# EAGLE schematic kog (EAGLE 6.5.0)
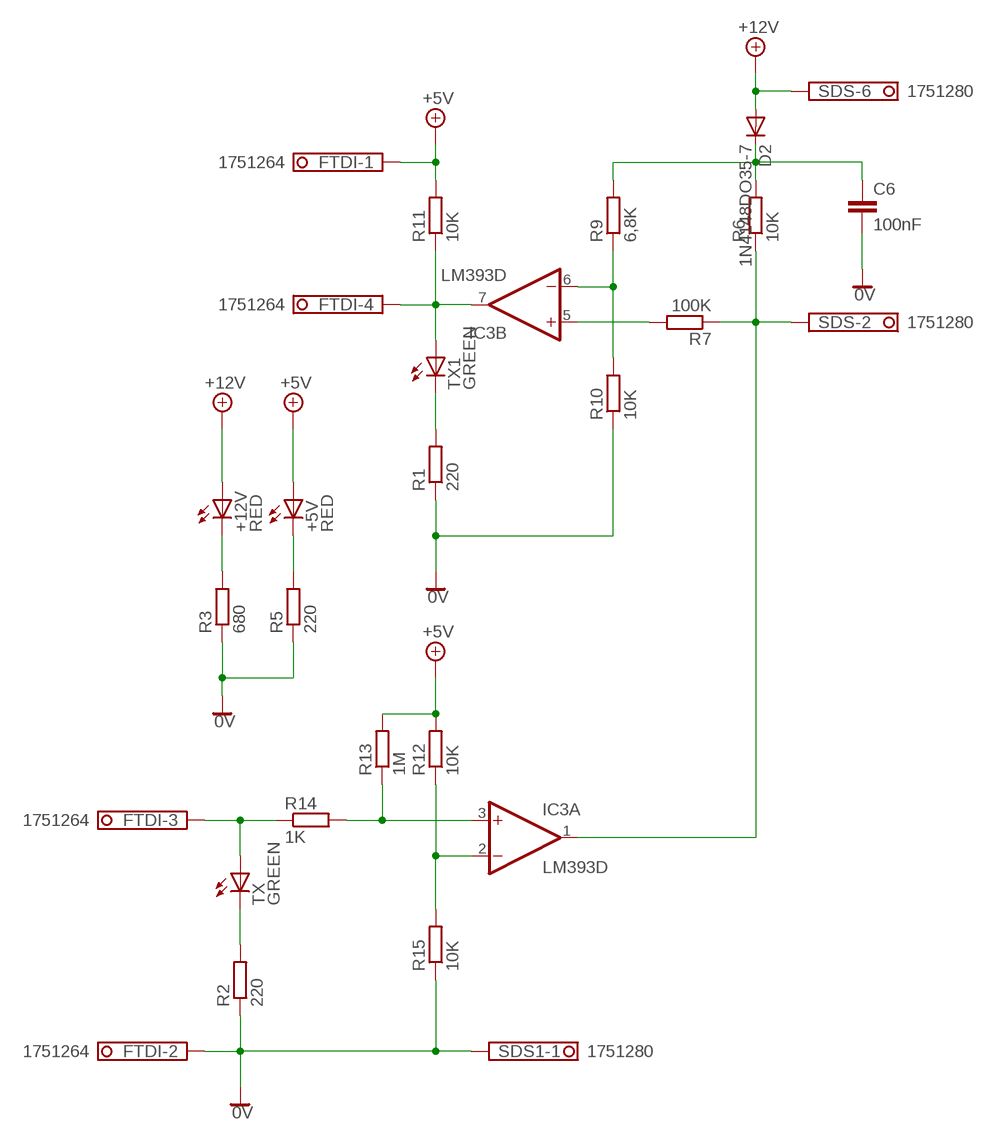
[diagram p0: schematic, sheet 1]

## Parts
+5V  RED  LED5MM  [LED5MM]
+12V  RED  LED5MM  [LED5MM]
C6  100nF  C-EU025-025X050  [C025-025X050]
D2  1N4148DO35-7  [DO35-7]
FTDI  1751264  [1751264]
IC3  LM393D  [SO08]
R1  220  R-EU_0207/10  [0207/10]
R2  220  R-EU_0207/10  [0207/10]
R3  680  R-EU_0207/10  [0207/10]
R5  220  R-EU_0207/10  [0207/10]
R6  10K  R-EU_0207/10  [0207/10]
R7  100K  R-EU_0207/10  [0207/10]
R9  6,8K  R-EU_0207/10  [0207/10]
R10  10K  R-EU_0207/10  [0207/10]
R11  10K  R-EU_0207/10  [0207/10]
R12  10K  R-EU_0207/10  [0207/10]
R13  1M  R-EU_0207/10  [0207/10]
R14  1K  R-EU_0207/10  [0207/10]
R15  10K  R-EU_0207/10  [0207/10]
SDS  1751280  [1751280]
SDS1  1751280  [1751280]
TX  GREEN  LED5MM  [LED5MM]
TX1  GREEN  LED5MM  [LED5MM]

## Nets
0V: C6.2 FTDI.2 R1.1 R2.1 R3.1 R5.1 R10.1 R15.1 SDS1.1
+5V: +5V.A FTDI.1 R11.2 R12.2 R13.2
+12V: +12V.A D2.A SDS.6
N$1: +12V.K(C) R3.2
N$2: C6.1 D2.C R6.2 R9.2
N$3: IC3.1(A:OUT) R6.1 R7.1 SDS.2
N$4: IC3.5(B:+IN) R7.2
N$5: IC3.6(B:-IN) R9.1 R10.2
N$7: R1.2 TX1.K(C)
N$8: +5V.K(C) R5.2
N$10: FTDI.4 IC3.7(B:OUT) R11.1 TX1.A
N$11: IC3.3(A:+IN) R13.1 R14.2
N$12: IC3.2(A:-IN) R12.1 R15.2
N$16: FTDI.3 R14.1 TX.A
N$17: R2.2 TX.K(C)
Unconnected: SDS1.2 SDS1.3 SDS1.4 SDS1.5 SDS1.6 SDS.1 SDS.3 SDS.4 SDS.5

## Power pins joined to a net without a drawn wire
V+: IC3.8(P:V+)
V-: IC3.4(P:V-)

## Library data of the parts
+5V +12V TX TX1 = led:LED: LED OSRAM: - CHIPLED LG R971, LG N971, LY N971, LG Q971, LY Q971, LO R971, LY R971 LH N974, LH R974 LS Q976, LO Q976, LY Q976 LO Q996 - Hyper CHIPLED LW Q18S LB Q993, LB Q99A, LB R99A - SideLED LS A670, LO A670, LY A670, LG A670, LP A670 LB A673, LV A673, LT A673, LW A673 LH A674 LY A675 LS A676, LA A676, LO A676, LY A676, LW A676 LS A679, LY A679, LG A679 - Hyper Micro SIDELED® LS Y876, LA Y876, LO Y876, LY Y876 LT Y87S - SmartLED LW L88C, LW L88S LB L89C, LB L89S, LG L890 LS L89K, LO L89K, LY L89K LS L896, LA L896, LO L896, LY L896 - TOPLED LS T670, LO T670, LY T670, LG T670, LP T670 LSG T670, LSP T670, LSY T670, LOP T670, LYG T670 LG T671, LOG T671, LSG T671 LB T673, LV T673, LT T673, LW T673 LH T674 LS T676, LA T676, LO T676, LY T676, LB T676, LH T676, LSB T676, LW T676 LB T67C, LV T67C, LT T67C, LS T67K, LO T67K, LY T67K, LW E67C LS E67B, LA E67B, LO E67B, LY E67B, LB E67C, LV E67C, LT E67C LW T67C LS T679, LY T679, LG T679 LS T770, LO T770, LY T770, LG T770, LP T770 LB T773, LV T773, LT T773, LW T773 LH T774 LS E675, LA E675, LY E675, LS T675 LS T776, LA T776, LO T776, LY T776, LB T776 LHGB T686 LT T68C, LB T68C - Hyper Mini TOPLED® LB M676 - Mini TOPLED Santana® LG M470 LS M47K, LO M47K, LY M47K Source: http://www.osram.convergy.de LUXEON: - LUMILED® LXK2-PW12-R00, LXK2-PW12-S00, LXK2-PW14-U00, LXK2-PW14-V00 LXK2-PM12-R00, LXK2-PM12-S00, LXK2-PM14-U00 LXK2-PE12-Q00, LXK2-PE12-R00, LXK2-PE12-S00, LXK2-PE14-T00, LXK2-PE14-U00 LXK2-PB12-K00, LXK2-PB12-L00, LXK2-PB12-M00, LXK2-PB14-N00, LXK2-PB14-P00, LXK2-PB14-Q00 LXK2-PR12-L00, LXK2-PR12-M00, LXK2-PR14-Q00, LXK2-PR14-R00 LXK2-PD12-Q00, LXK2-PD12-R00, LXK2-PD12-S00 LXK2-PH12-R00, LXK2-PH12-S00 LXK2-PL12-P00, LXK2-PL12-Q00, LXK2-PL12-R00 Source: www.luxeon.com KINGBRIGHT: KA-3528ASYC Source: www.kingbright.com
C6 = rcl:C-EU: CAPACITOR, European symbol
D2 = diode:1N4148: DIODE high speed (Philips)
FTDI = con-phoenix-350:1751264: MKDS 1/ 4-3,5 Printklemme Nennstrom: 10 A Bemessungsspannung: 160 V Raster: 3,5 mm Polzahl: 4 Montageart: Löten Anschlussart: Schraubanschluss Anschlussrichtung vom Leiter zur Platine: 0° Source: http://eshop.phoenixcontact.com .. 1751264.pdf; MPN: 1751264; OC_FARNELL: unknown; OC_NEWARK: 10R0934
IC3 = linear:LM393: COMPARATOR
R1-R3 R5-R7 R9-R15 = rcl:R-EU_: RESISTOR, European symbol
SDS SDS1 = con-phoenix-350:1751280: MKDS 1/ 6-3,5 Printklemme Nennstrom: 10 A Bemessungsspannung: 160 V Raster: 3,5 mm Polzahl: 6 Montageart: Löten Anschlussart: Schraubanschluss Anschlussrichtung vom Leiter zur Platine: 0° Source: http://eshop.phoenixcontact.com .. 1751280.pdf; MPN: 1751280; OC_FARNELL: unknown; OC_NEWARK: 27R1765